# Altium schematic sheet MicroController USB to UART Converter.SchDoc: USB to UART Converter
size 292 x 193 mm; SheetNumber: 39; SheetTotal: 40
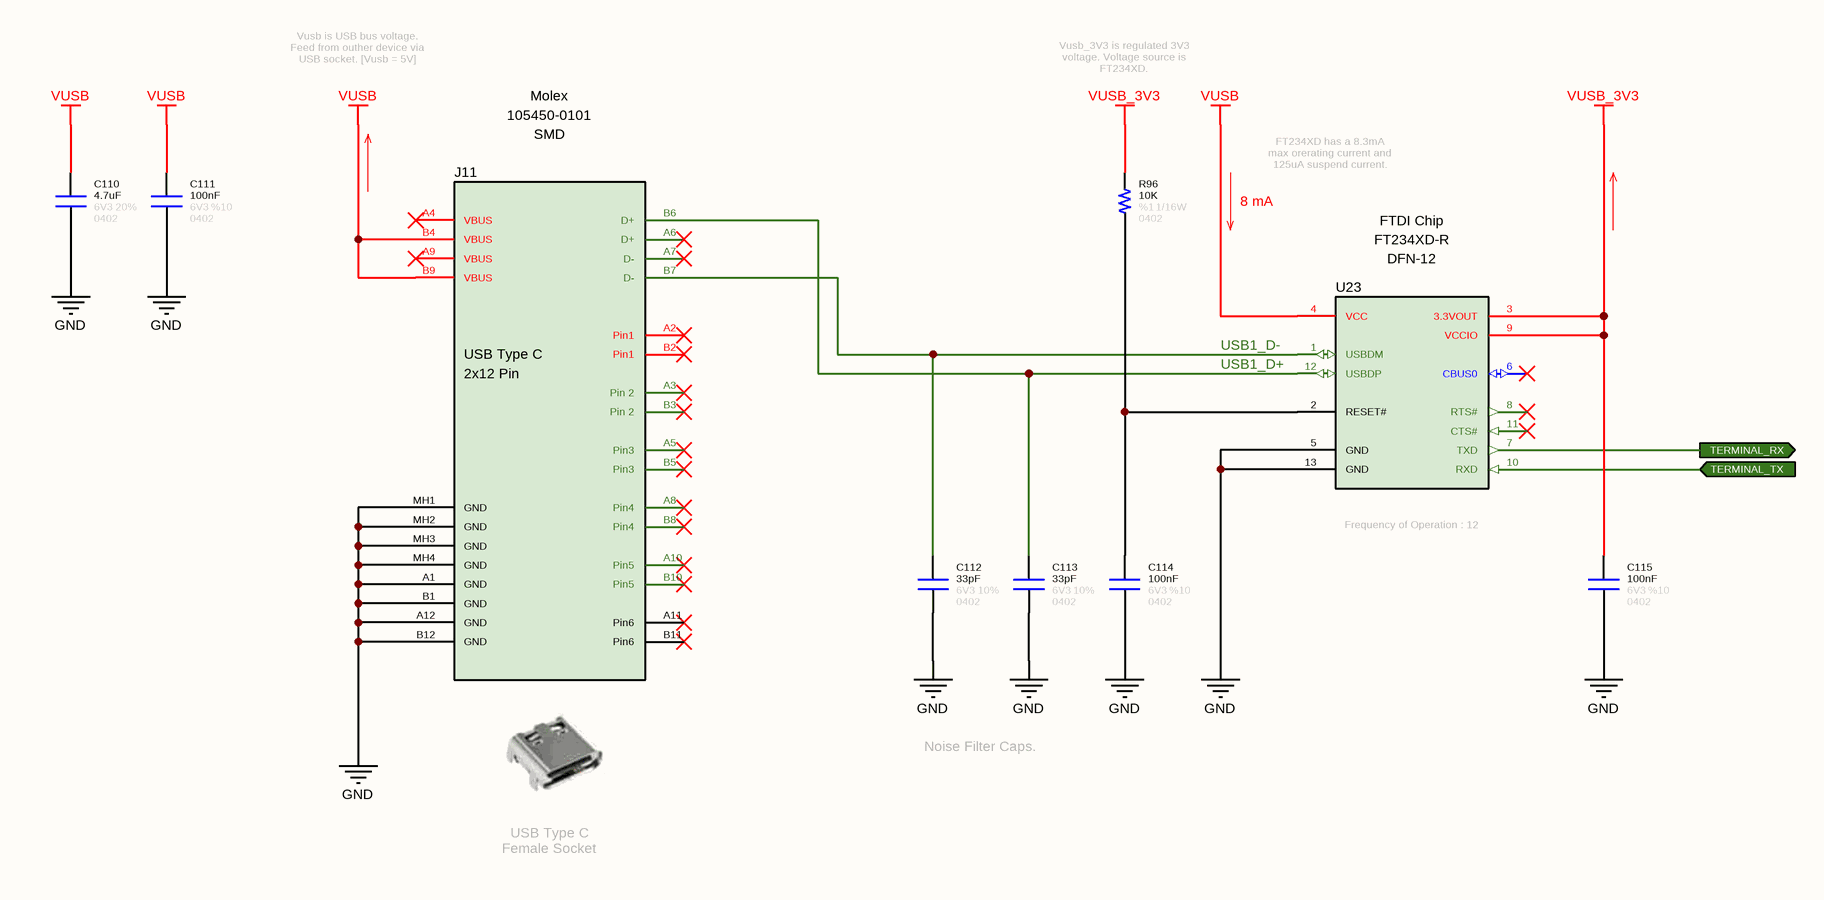
[diagram p0: MicroController USB to UART Converter.SchDoc]

## Parts
C110  value 4.7uF  Tolerance: 20%  Case: 0402  Voltage: 6V3  [CAPACITOR_0402]  (hidden comment: Capacitor - 4.7uF [0402] (Ceramic))
C111  value 100nF  Tolerance: %10  Voltage: 6V3  Case: 0402  [CAPACITOR_0402]  (hidden comment: Capacitor - 100nF [0402] (Ceramic))
C112  value 33pF  Tolerance: 10%  Case: 0402  Voltage: 6V3  [CAPACITOR_0402]  (hidden comment: Capacitor - 33pF [0402] (Ceramic))
C113  value 33pF  Tolerance: 10%  Case: 0402  Voltage: 6V3  [CAPACITOR_0402]  (hidden comment: Capacitor - 33pF [0402] (Ceramic))
C114  value 100nF  Tolerance: %10  Voltage: 6V3  Case: 0402  [CAPACITOR_0402]  (hidden comment: Capacitor - 100nF [0402] (Ceramic))
C115  value 100nF  Tolerance: %10  Voltage: 6V3  Case: 0402  [CAPACITOR_0402]  (hidden comment: Capacitor - 100nF [0402] (Ceramic))
J11  Manufacturer Name: Molex  Case: SMD  [USB Type C - Molex 105450-0101]  (hidden comment: 105450-0101)
R96  value 10K  Tolerance: %1  Case: 0402  Power: 1/16W  [RESISTOR_0402]  (hidden comment: 10K - 0402 - %1 - 1/16W)
U23  Manufacturer Name: FTDI Chip  Case: DFN-12  [FT234XD-R]  (hidden comment: FT234XD-R)

## Ports
TERMINAL_RX (out), TERMINAL_TX (in)

## Nets
GND: C110.1 C111.1 C112.1 C113.1 C114.1 C115.1 J11.A1(GND) J11.A12(GND) J11.B1(GND) J11.B12(GND) J11.MH1(GND) J11.MH2(GND) J11.MH3(GND) J11.MH4(GND) U23.5(GND) U23.13(GND)
VUSB: C110.2 C111.2 J11.B4(VBUS) J11.B9(VBUS) U23.4(VCC)
VUSB_3V3: C115.2 R96.2 U23.3(3.3VOUT) U23.9(VCCIO)
TERMINAL_RX: U23.7(TXD) ; port TERMINAL_RX
TERMINAL_TX: U23.10(RXD) ; port TERMINAL_TX
USB1_D+: C113.2 J11.B6(D+) U23.12(USBDP)
USB1_D-: C112.2 J11.B7(D-) U23.1(USBDM)
NetC114_2: C114.2 R96.1 U23.2(RESET#)

Not connected (* = marked no-connect by the designer): J11 A2(Pin1)* A3(Pin_2)* A4(VBUS)* A5(Pin3)* A6(D+)* A7(D-)* A8(Pin4)* A9(VBUS)* A10(Pin5)* A11(Pin6)* B2(Pin1)* B3(Pin_2)* B5(Pin3)* B8(Pin4)* B10(Pin5)* B11(Pin6)*; U23 6(CBUS0)* 8(RTS#)* 11(CTS#)*

## Notes on the sheet
- Vusb is USB bus voltage. Feed from outher device via USB socket. [Vusb = 5V]
- Vusb_3V3 is regulated 3V3 voltage. Voltage source is FT234XD.
- 8 mA
- FT234XD has a 8.3mA max orerating current and 125uA suspend current.
- (near U23) Frequency of Operation : 12 MHz
- Noise Filter Caps.
- USB Type C
  Female Socket
- © 2022 All rights reserved.
  This document may not, in whole or in part, be copied, photocopied, reproduced, translated or converted to any electronic or machine readable from without prior written permission of Mehmet Günce Akkoyun.
  Engineer contact : akkoyun@me.com
- Property of
- Engineer :
- Date :
- Size :
- A4
- Time :
- Project :
- Page :
- /
- Customer :
- Product ID :
- Module ID :
- Version :
- File :
- Revision :
- (in symbol Connector - USB Type C SMD Connector) USB Type C; 2x12 Pin

## Library data of the parts
C110 = Capacitor - 4.7uF [0402-6V3]: Multilayer Ceramic Capacitors - SMD - 6V3 4.7uF X5R 0402 20%; Manufacturer Part Number: C0402C475M9PACTU; Manufacturer Name: KEMET
C111 C114 C115 = Capacitor - 100nF [0402-6V3]: Capacitor - 100nF [0402-6V3] (Ceramic); Manufacturer Name: AVX; Manufacturer Part Number: 04026D104KAT4A; ComponentLink1Description: Mouser; ComponentLink1URL: https://www.mouser.com.tr/ProductDetail/AVX/04026D104KAT4A?qs=sGAEpiMZZMs0AnBnWHyRQPg4iYkCw7IMED%2F4kpqgf7w%3D; ComponentLink2Description: DataSheet; ComponentLink2URL: https://www.mouser.com.tr/datasheet/2/40/cx5r-776519.pdf
C112 C113 = Capacitor - 33pF [0402-6V3]: Manufacturer Name: Kemet; Manufacturer Part Number: C0402C330J9RACAUTO; ComponentLink1Description: DataSheet; ComponentLink1URL: https://api.kemet.com/component-edge/download/datasheet/C0402C330J9RACAUTO.pdf; ComponentLink2Description: Mouser; ComponentLink2URL: https://www.mouser.com/Search/Refine.aspx?Keyword=80-C0402C330J9RAUTO
J11 = Connector - USB Type C SMD Connector: USB Shielded I/O Receptacle; Type C; Right Angle; Surface Mount; Gold over Nickel; Current Rating: 5 A.; Gender: Jack (Female); Number of Contacts: 24 Contact; Voltage Rating: 30 V; Maximum Operating Temperature: + 85 C; Minimum Operating Temperature: - 30 C; Mounting Angle: Right Angle; Product Type: USB Connectors; RoHS: Yes; Manufacturer Part Number: 105450-0101
R96 = Resistor - 10K [0402]: Thick Film Resistors - SMD 1/16 W 10 KOhm 1%; Manufacturer Name: Vishay; Manufacturer Part Number: CRCW040210K0FKED; ComponentLink1Description: DataSheet; ComponentLink1URL: https://www.mouser.com.tr/datasheet/2/427/dcrcwe3-1762152.pdf; ComponentLink2Description: Mouser; ComponentLink2URL: https://www.mouser.com.tr/ProductDetail/Vishay-Dale/CRCW040210K0FKED?qs=sGAEpiMZZMu61qfTUdNhG2DpbjADlD3GcalbOv9utCY%3D
U23 = IC - FT234XD-R: USB Interface IC USB to Serial UART Interface; Data Rate: 12 Mb/s; Interface Type: UART, USB; Number of Ports: 1 Port; Maximum Operating Temperature: + 85 C; Minimum Operating Temperature: - 40 C; Product Type: USB Interface IC; RoHS: Yes; Manufacturer Part Number: FT234XD-R